# Altium schematic sheet PWM_Signal_Amplifiers.SchDoc
size A; Organization: Altium Limited; Address1: L3, 12a Rodborough Rd; Address2: Frenchs Forest; Address3: NSW; Address4: Australia 2086
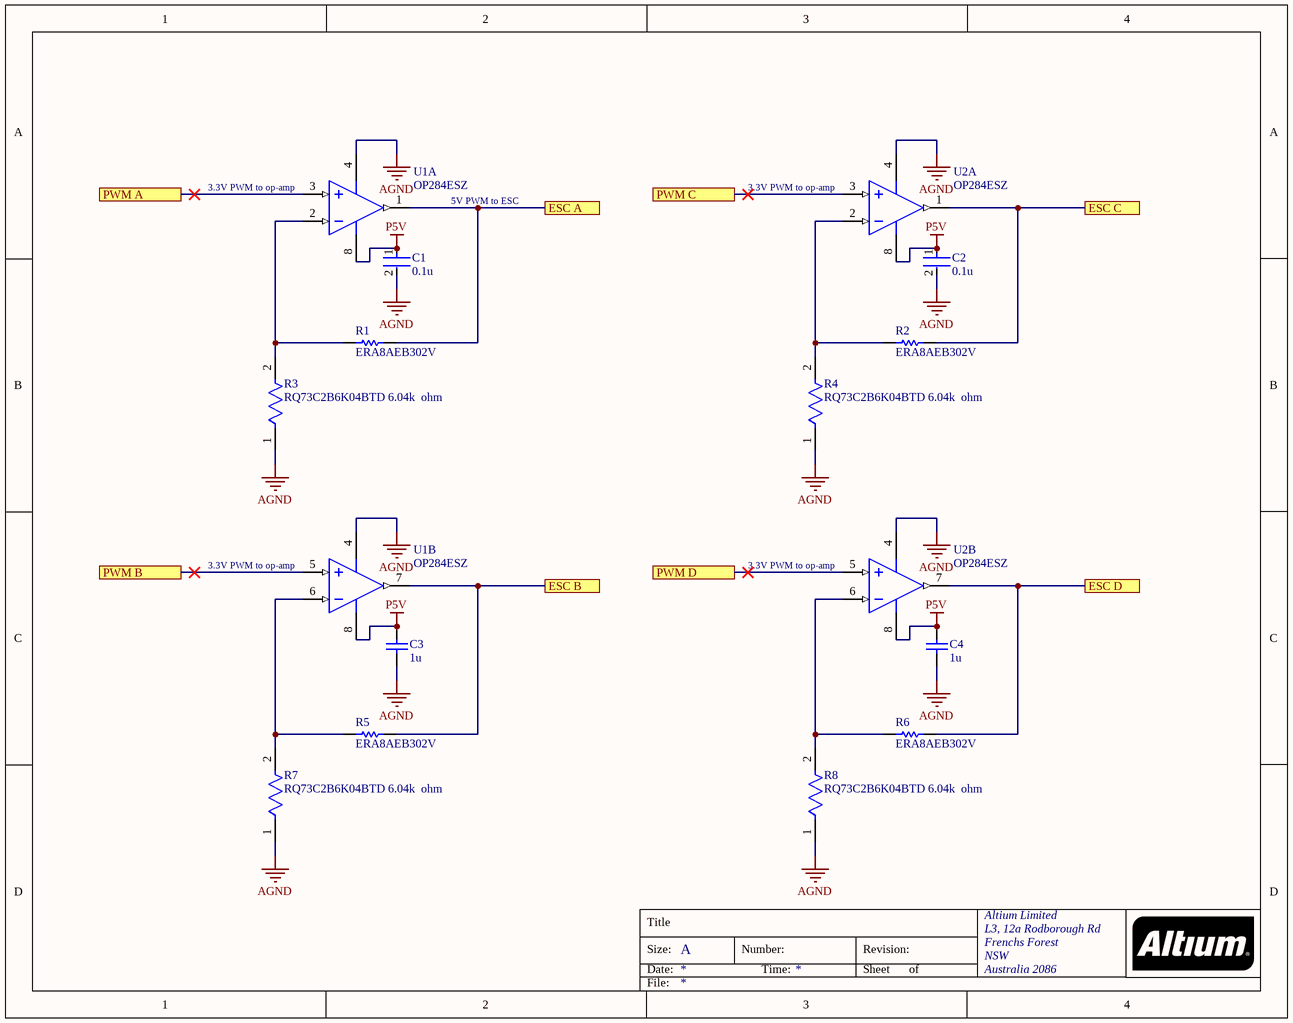
[diagram p0: PWM_Signal_Amplifiers.SchDoc]

## Parts
C1  0.1u  [FP-C0402-BB-MFG]
C2  0.1u  [FP-C0402-BB-MFG]
C3  1u  [CAPC3216X110X50LL20T25]
C4  1u  [CAPC3216X110X50LL20T25]
R1  ERA8AEB302V  [RESC3216X70X50ML20T25]
R2  ERA8AEB302V  [RESC3216X70X50ML20T25]
R3  RQ73C2B6K04BTD 6.04k  ohm  [FP-RQ732B-IPC_C]
R4  RQ73C2B6K04BTD 6.04k  ohm  [FP-RQ732B-IPC_C]
R5  ERA8AEB302V  [RESC3216X70X50ML20T25]
R6  ERA8AEB302V  [RESC3216X70X50ML20T25]
R7  RQ73C2B6K04BTD 6.04k  ohm  [FP-RQ732B-IPC_C]
R8  RQ73C2B6K04BTD 6.04k  ohm  [FP-RQ732B-IPC_C]
U1  OP284ESZ  [ADI-R-8_L]  (parts A,B of 2)
U2  OP284ESZ  [ADI-R-8_L]  (parts A,B of 2)

## Ports
ESC A, ESC B, ESC C, ESC D, PWM A, PWM B, PWM C, PWM D

## Nets
AGND: C1.2 C2.2 C3.1 C4.1 R3.1 R4.1 R7.1 R8.1 U1.4(-V) U2.4(-V)
P5V: C1.1 C2.1 C3.2 C4.2 U1.8(+V) U2.8(+V)
ESC A: R1.2 U1.1(OUT_A) ; port ESC A
ESC B: R5.2 U1.7(OUT_B) ; port ESC B
ESC C: R2.2 U2.1(OUT_A) ; port ESC C
ESC D: R6.2 U2.7(OUT_B) ; port ESC D
PWM A: U1.3(+IN_A) ; port PWM A
PWM B: U1.5(+IN_B) ; port PWM B
PWM C: U2.3(+IN_A) ; port PWM C
PWM D: U2.5(+IN_B) ; port PWM D
NetR1_1: R1.1 R3.2 U1.2(-IN_A)
NetR2_1: R2.1 R4.2 U2.2(-IN_A)
NetR5_1: R5.1 R7.2 U1.6(-IN_B)
NetR6_1: R6.1 R8.2 U2.6(-IN_B)

## Notes on the sheet
- (near U1) 3.3V PWM to op-amp
- 5V PWM to ESC
- (near U2) 3.3V PWM to op-amp
- Title
- Size:
- Date:
- A
- Number:
- Time:
- Revision:
- Sheet
- of
- File:

## Library data of the parts
C1 C2 = CMP-2008-02046-2: CAP CER 0.1UF 10V X5R 0402; Manufacturer: Kemet; Manufacturer Part Number: C0402C104K8PACTU; Material: Ceramic; Capacitance: 0.10 μF; Temperature Coefficient: 15%; Tolerance: 0.1; Value: 0.10 μF; Package: C0402-BB; Temperature: -55°C to +125°C; ComponentLink2Description: Datasheet; Temperature Characteristic: X5R; Device Class L1: Passive Components; Height: 0.55mm; Lead Free: Yes; ComponentLink2URL: https://content.kemet.com/datasheets/KEM_C1002_X7R_SMD.pdf; Device Class L2: Capacitors; Temperature Range Low: -55°C; Temperature Range High: +125°C; RoHS: TRUE; Octopart: https://octopart.com/c0402c104k8pactu-kemet-140039; Automotive: No; Mouser Description: Capacitor 100 nF 10 VDC 0402; Category: Cap; Voltage Rating: 10 V; Digikey Description: CAP CER 0.1UF 10V X5R 0402; Ipc Land Pattern Name: CAPC10050X50; Device Class L3: Ceramic Capacitors
C3 C4 = CMP-2000-06011-1: Chip Capacitor, 1 uF, +/- 10%, 50 V, -55 to 125 degC, 1206 (3216 Metric), RoHS, Tape and Reel; Manufacturer: Kemet; Case Height: 1mm; Dielectric: X7R; Voltage Rating: 50V; Capacitance: 1uF; Temperature Coefficient / Code: +/-15%; Case Length: 3.2mm; Case Width: 1.6mm; Type: SMDMLCCX7R6.3-250VDCCommericalGrade; Class: Class1; Capacitance - nF: 1000nF; Datasheet URL: http://www.kemet.com/docfinder?Partnumber=C1206C105K5RACTU; Product Category: MultilayerCeramicCapacitorsMLCC-SMD/SMT; Termination Style: SMD/SMT; Dimensions: 1.6mmWx3.2mmLx1mmH; Voltage Rating DC: 50V; Datasheet Version: 02/2016; Packaging: Reel; Brand: Kemet; RoHS: Details; Minimum Operating Temperature: -55C; Operating Temperature Range: -55Cto+125C; Package Reference: 1206; Manufacturer URL: http://www.kemet.com/; Product: GeneralTypeMLCCs; Tolerance: 10%; Package Description: 2-Pin Surface Mount Device, Body 3.2 x 1.6 mm; Mounting Technology: SurfaceMount; Case Code - mm: 3216; Maximum Operating Temperature: +125C; Series: C1206C; Factory Pack Quantity: 2500; Package / Case: 1206(3216metric); Case Code - in: 1206
R1 R2 R5 R6 = CMP-2003-04451-1: Manufacturer: Panasonic; Part Number: ERA8AEB302V
R3 R4 R7 R8 = CMP-03211-007803-1: RQ732B 1206 6.04KΩ 0.4W 10ppm/°C 0.1% 200V; Manufacturer: TE; Automotive Grade: Grade 0; Device Class L1: Passive Components; Device Class L3: Chip SMD Resistors; ComponentLink2URL: https://www.te.com/commerce/DocumentDelivery/DDEController?Action=showdoc&DocId=Data+Sheet%7F1773270-2%7FA%7Fpdf%7FEnglish%7FENG_DS_1773270-2_A.pdf%7F9-2176388-439; Voltage Rating: 200V; Category: Res; Device Class L2: Resistors; Height: 0.75mm; Temperature: -55°C to +155°C; Temperature Range High: +155°C; Temperature Range Low: -55°C; Temperature Coefficient: 10ppm/°C; Tolerance: 0.1%; RoHS: TRUE; Ipc Land Pattern Name: RESC310160X60; Value: 6.04KΩ; Power Rating: 0.4W; ComponentLink2Description: Datasheet; Automotive: Yes; Lead Free: Yes; Resistance: 6.04KΩ; Manufacturer Part Number: RQ73C2B6K04BTD; Composition: Thin Film; Octopart: https://octopart.com/rq73c2b6k04btd-te+connectivity-93912055; Series: RQ73; Package: RQ732B
U1 U2 = CMP-0384-00701-1: Double Channel Single-Supply Operation Operational Amplifier, 4.25 MHz BW, 4 V/us SR, Industrial, 8-pin SOIC (R-8), Tube; Generic Part Number: OP284; Manufacturer: Analog Devices; Slew Rate: 4V/us; Amplifiers Per Package: 2; Input Offset Voltage: 175uV; V Span Max: 36V; Iq/Amp: 2mA; V Span Min: 3V; Input Bias Current: 80nA; ComponentLink1URL: http://www.analog.com/en/index.html; PackageReference: R-8; Code_JEDEC: MS-012-AA; Small Signal Bandwidth: 4.25MHz; DatasheetVersion: Rev. J; PackageDescription: 8-Pin Standard Small Outline Package, Body 3.9 x 4.9 mm, Pitch 1.27 mm; ComponentLink3Description: Package Specification; PackageVersion: 060506-A; ComponentLink2Description: Datasheet; ComponentLink3URL: http://www.analog.com/static/imported-files/packages/PKG_PDF/SOIC_Narrow%20(R)/R_8.pdf; Mounting Technology: Surface Mount; ComponentLink2URL: http://www.analog.com/static/imported-files/data_sheets/OP184_284_484.pdf; PartNumber: OP284ESZ; ComponentLink1Description: Manufacturer URL